# EasyEDA Pro project ProPrj_ESP DigiCam.epro

# Schematic Schematic1
Board Name: Board1; Create Date: 2026-06-13; Page Name: P1; Project Name: ESP DigiCam; Schematic Name: Schematic1; Update Date: 2026-06-13; Company: EasyEDA.com; Page Size: A4; Version: V1.0
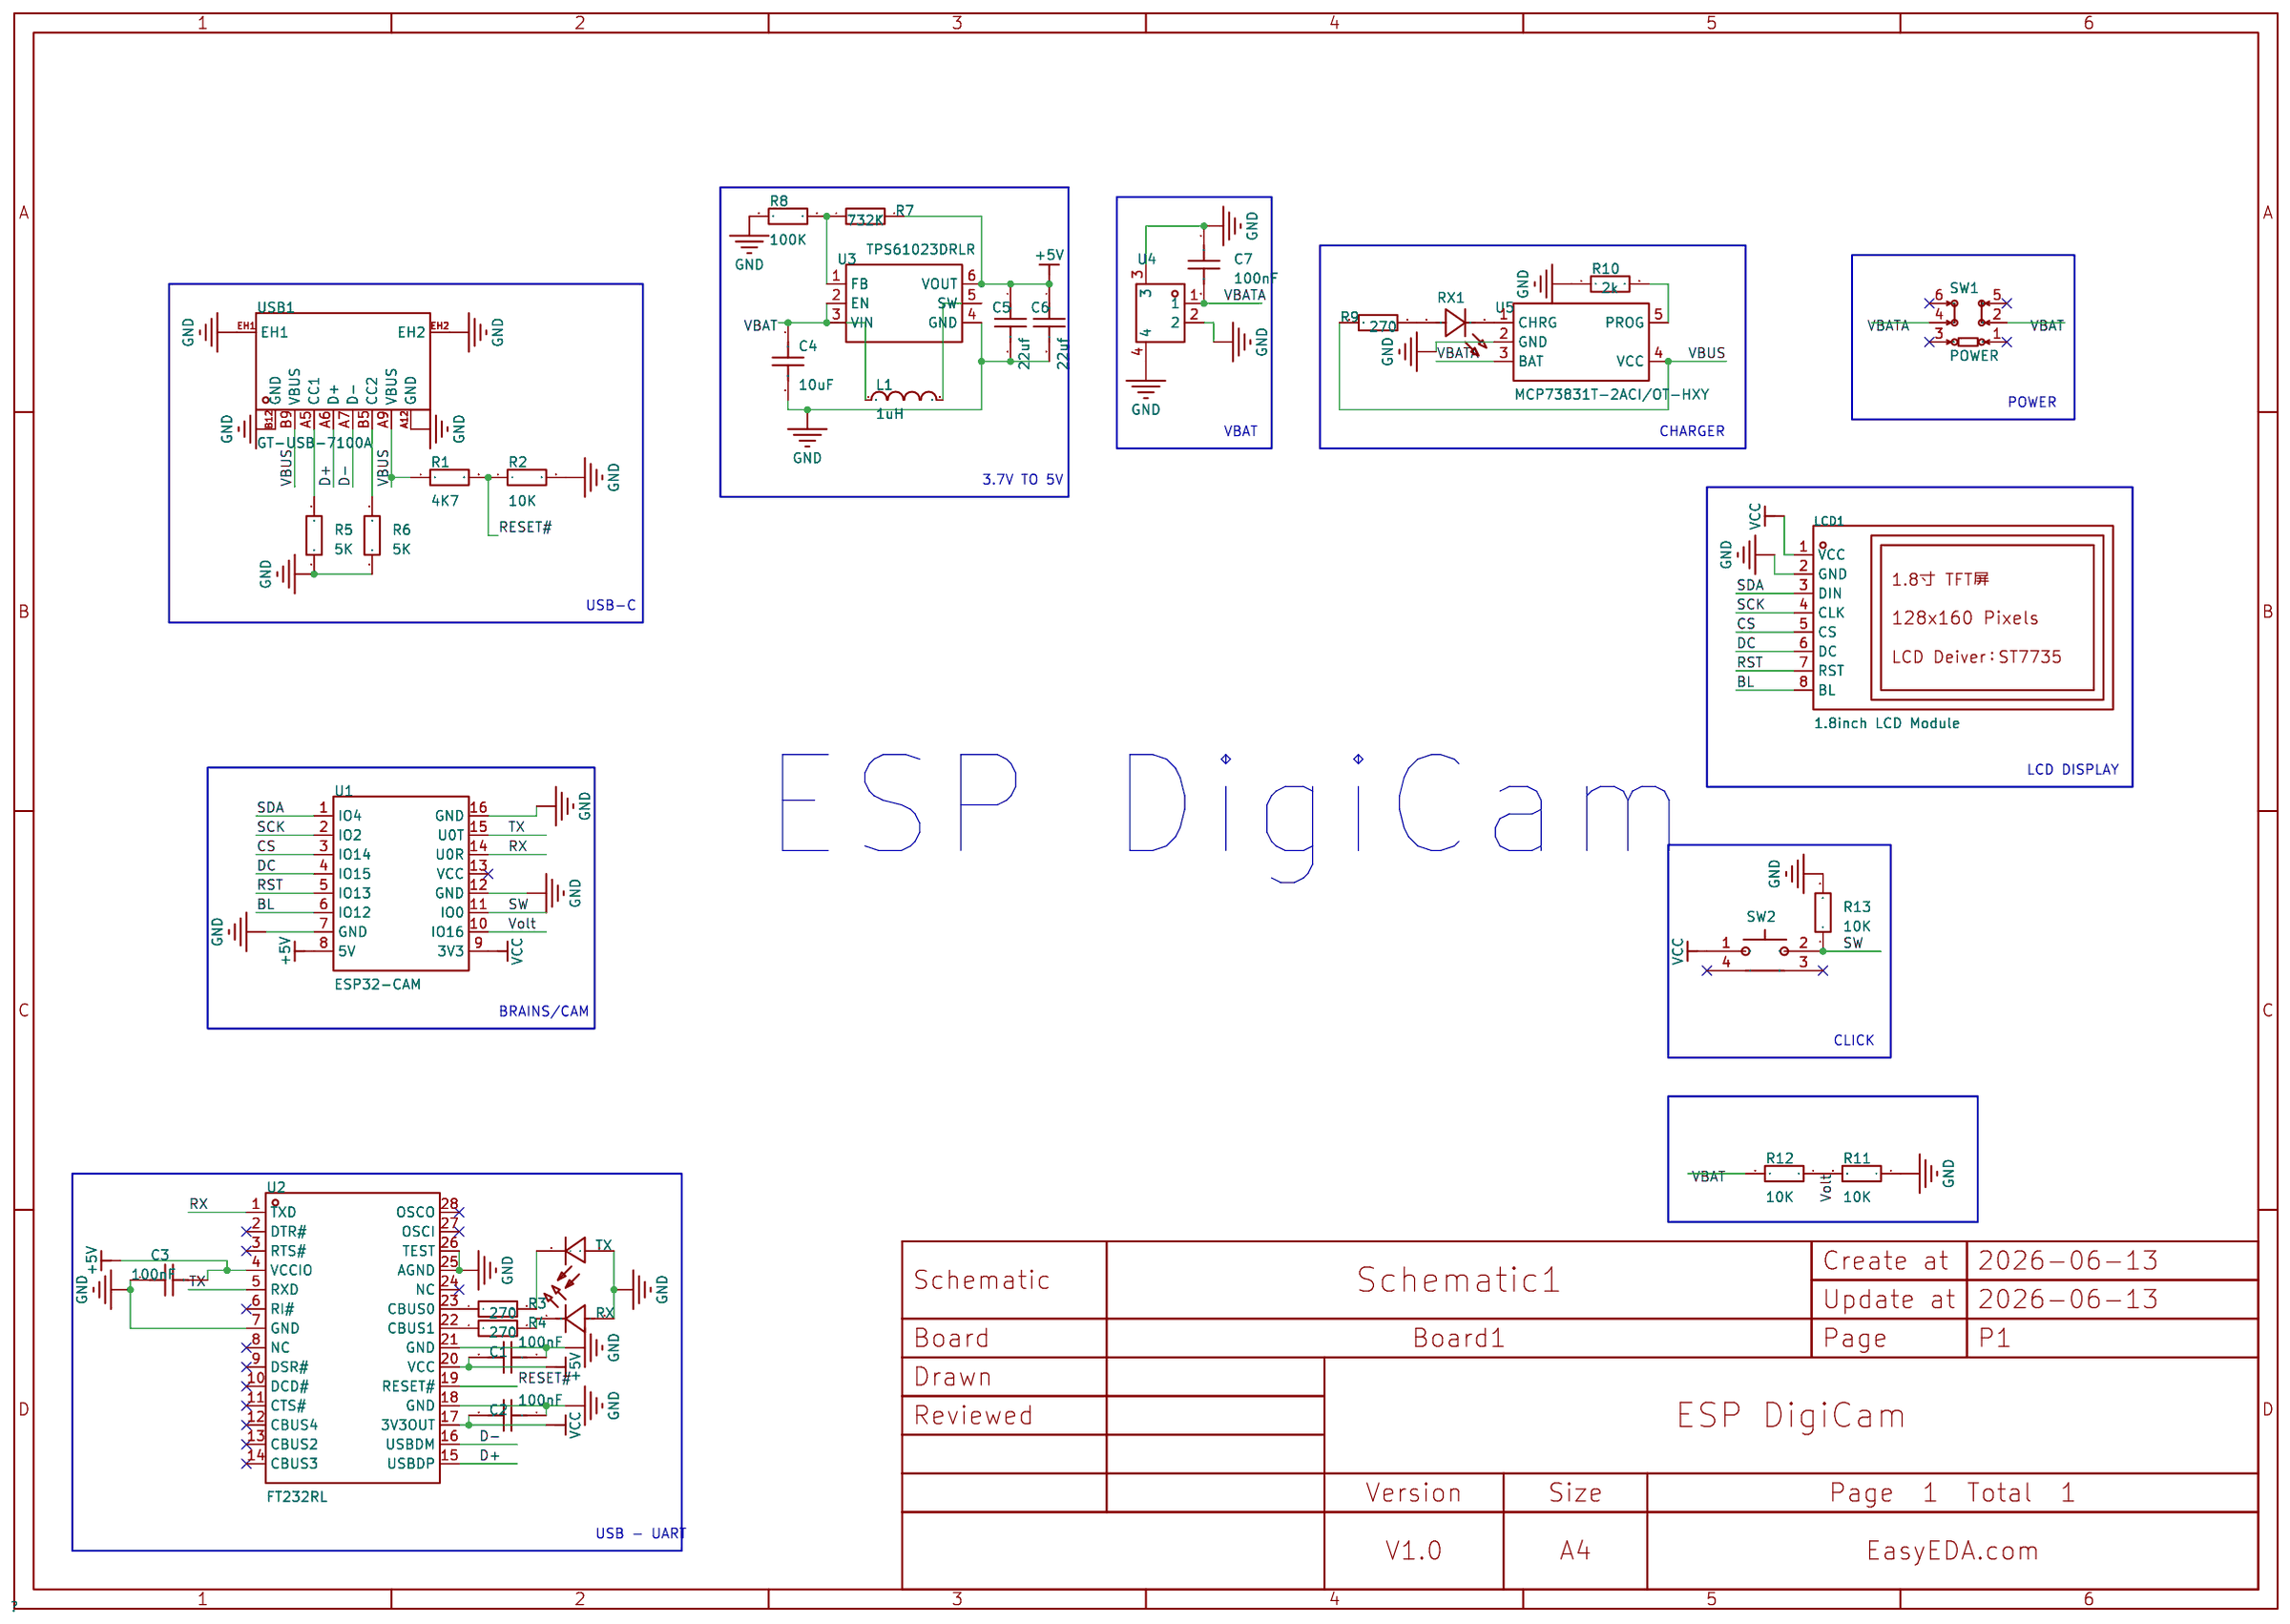
[diagram p0: schematic sheet]

## Parts
C1  100nF  [C0603]
C2  100nF  [C0603]
C3  100nF  [C0603]
C4  10uF  [C0603]
C5  22uf  [C0603]
C6  22uf  [C0603]
C7  100nF  [C0603]
L1  1uH  [IND-SMD_L4.2-W4.2_MCW-0420]
LCD1  1.8inch LCD Module  [LCD-TH_L56.5-W34.0_1-8INCH-LCD-MODULE]
R1  4K7  [R0603]
R2  10K  [R0603]
R3  270  [R0603]
R4  270  [R0603]
R5  5K  [R0603]
R6  5K  [R0603]
R7  732K  [R0603]
R8  100K  [R0603]
R9  270  [R0603]
R10  2k  [R0603]
R11  10K  [R0603]
R12  10K  [R0603]
R13  10K  [R0603]
RX  YLED0603B  [LED0603-FD]
RX1  YLED0603B  [LED0603-FD]
SW1  POWER  [SW-SMD_XKB5858-W-F-75]
SW2  1TS002G-1400-3500-CT  [KEY-SMD_1TS002G]
TX  YLED0603R  [LED0603-FD]
U1  ESP32-CAM  [COMM-TH_16P-L40.0-W27.0-P2.54_ESP32-CAM]
U2  FT232RL  [SSOP-28_L10.2-W5.3-P0.65-LS7.8-BL]
U3  TPS61023DRLR  [SOT-563_L1.6-W1.2-P0.50-LS1.6-BR]
U4  JST Right-Angle Connector - SMD 2-Pin (Black)  [CONN-SMD_JST-PH-2-SMT-RA]
U5  MCP73831T-2ACI/OT-HXY  [SOT-23-5_L2.9-W1.6-P0.95-LS2.8-TL]
USB1  GT-USB-7100A  [USB-C-SMD_GT-USB-7100A]

## Library data of the parts
C1-C7 = CAP_0603: Supplier Footprint: 0603
L1 = 0420CDMCCDS-1R0MC: Inductance: Tolerance:±20% Tolerance:±20% Rated Current: Saturation Current (Isat):8A DC Resistance (DCR): Type:- Ratings:-; LCSC Part Name: 1uH ±20% 8A; Supplier Part: C609522; Manufacturer: Sumida(胜美达); Supplier Footprint: SMD,4.4x4.2mm; JLCPCB Part Class: Extended Part; Datasheet: https://atta.szlcsc.com/upload/public/pdf/source/20200615/C609522_5666D83977AE4FEBC39B900529322ACF.pdf; Supplier: LCSC; Tolerance: ±20%; Saturation Current (Isat): 8A
LCD1 = 1.8inch LCD Module: Controller Type:ST7735S chip Interface:SPI Size:1.8 Dot Pixels:160x128 Operating Temperature:-30℃~+85℃ Operating Temperature:-30℃~+85℃ Display Range:35.4x28.03mm Voltage - Supply:3.3V Voltage - Supply:3.3V Function:Touch; LCSC Part Name: 树莓派 1.8寸LCD 迷你显示屏 扩展板 SPI接口 支持Arduino; Supplier Part: C359940; Manufacturer: Waveshare(微雪电子); JLCPCB Part Class: Extended Part; Datasheet: https://item.szlcsc.com/datasheet/1.8inch%2520LCD%2520Module/334757.html; Supplier: LCSC; Controller Type: ST7735S chip; Interface: SPI; Size: 1.8; Dot Pixels: 160x128; Operating Temperature: -30℃~+85℃; Display Range: 35.4x28.03mm; Voltage - Supply: 3.3V; Function: Touch
R1-R13 = Res_0603: Supplier Footprint: 0603
RX RX1 = YLED0603B: Lamp Holder Type:- Illumination Color:Blue Voltage - Forward(Vf):2.6V~3.2V Voltage - Forward(Vf):2.6V~3.2V Power(Watts):- Forward Current:30mA Wavelength - Dominant:460nm~475nm Wavelength - Dominant:460nm~475nm Peak Wavelength:- Diode Configuration:Discre; LCSC Part Name: 蓝色 独立二极管; Supplier Part: C19171394; Manufacturer: YONGYUTAI(永裕泰); Supplier Footprint: 0603; JLCPCB Part Class: Extended Part; Datasheet: https://item.szlcsc.com/datasheet/YLED0603B/20382445.html; Supplier: LCSC; Illumination Color: Blue; Voltage - Forward(Vf): 2.6V~3.2V; Forward Current: 30mA; Wavelength - Dominant: 460nm~475nm; Diode Configuration: Discrete Diode; Luminous Intensity: 42mcd~86mcd; Viewing Angle: 120°; Operating Temperature: -40℃~+85℃
SW1 = XKB5858-W-F-75: Self Lock / No Lock:Non-Latching Actuator Style:Square Button Mounting Type:Surface Mount, Right Angle Contact Current:100mA Voltage Rating:30V Actuator/Cap Color:White With Lamp:Without Termination Style:Gull Wing Operating Force:2.5N Operating Temperatu; LCSC Part Name: 轻操作力、低接触电阻按键开关; Supplier Part: C780037; Manufacturer: XKB Connection(中国星坤); Supplier Footprint: SMD; JLCPCB Part Class: Extended Part; Datasheet: https://item.szlcsc.com/datasheet/XKB5858-W-F-75/831887.html; Supplier: LCSC; Self Lock / No Lock: Non-Latching; Actuator Style: Square Button; Mounting Type: Surface Mount, Right Angle; Contact Current: 100mA; Voltage Rating: 30V; Actuator/Cap Color: White; With Lamp: Without; Termination Style: Gull Wing; Operating Force: 2.5N; Operating Temperature: -15℃~+55℃; Life: 100,000 cycles
SW2 = 1TS002G-1400-3500-CT: Circuit:SPST Actuator Style:Rectangular Button Operating Force:1.4N Mounting Type:Surface Mount, Right Angle Length:7.6mm Width:3.5mm Switch Height:3.5mm with Bracket:Without Bracket Contact Current:50mA Voltage Rating:12V Actuator/Cap Color:Black With La; LCSC Part Name: 7.6*3.5*3.5mm 卧贴 轻触开关; Supplier Part: C319373; Manufacturer: HYP(鸿源精密); Supplier Footprint: SMD,7.6x3.5mm; JLCPCB Part Class: Extended Part; Datasheet: https://item.szlcsc.com/datasheet/1TS002G-1400-3500-CT/300372.html; Supplier: LCSC; Circuit: SPST; Actuator Style: Rectangular Button; Operating Force: 1.4N; Mounting Type: Surface Mount, Right Angle; Length: 7.6mm; Width: 3.5mm; Switch Height: 3.5mm; with Bracket: Without Bracket; Contact Current: 50mA; Voltage Rating: 12V; Actuator/Cap Color: Black; With Lamp: No; Termination Style: J-Lead; Life: 50,000 Cycles; Operating Temperature: -40℃~+90℃
TX = YLED0603R: Lamp Holder Type:-；- Illumination Color:Red Voltage - Forward(Vf):1.8V~2.4V Voltage - Forward(Vf):1.8V~2.4V Power(Watts):- Forward Current:25mA Wavelength - Dominant:620nm~625nm Wavelength - Dominant:620nm~625nm Peak Wavelength:- Diode Configuration:Discr; LCSC Part Name: 红色 独立二极管; Supplier Part: C19171390; Manufacturer: YONGYUTAI(永裕泰); Supplier Footprint: 0603; JLCPCB Part Class: Extended Part; Datasheet: https://item.szlcsc.com/datasheet/YLED0603R/20382441.html; Supplier: LCSC; Lamp Holder Type: -；-; Illumination Color: Red; Voltage - Forward(Vf): 1.8V~2.4V; Forward Current: 25mA; Wavelength - Dominant: 620nm~625nm; Diode Configuration: Discrete Diode; Luminous Intensity: 120mcd; Viewing Angle: 120°; Operating Temperature: -40℃~+85℃
U1 = ESP32-CAM: Supplier Part: C277946; Manufacturer: Ai-Thinker(安信可); Supplier Footprint: 插件; JLCPCB Part Class: Extended Part; Datasheet: https://item.szlcsc.com/datasheet/ESP32-CAM/265266.html; Supplier: LCSC
U2 = FT232RL: Applications Function:USB to UART Protocol:USB 2.0 Number of Channels:- Voltage - Supply:4V~5.25V；3.3V~5.25V Voltage - Supply:4V~5.25V；3.3V~5.25V Data Rate:- Operating Temperature:-40℃~+85℃ Operating Temperature:-40℃~+85℃; LCSC Part Name: FT232R USB UART IC; Supplier Part: C490691; Manufacturer: FTDI(飞特帝亚); Supplier Footprint: SSOP-28-208mil; JLCPCB Part Class: Extended Part; Datasheet: https://item.szlcsc.com/datasheet/FT232RL/501648.html; Supplier: LCSC; Applications Function: USB to UART; Protocol: USB 2.0; Voltage - Supply: 4V~5.25V；3.3V~5.25V; Operating Temperature: -40℃~+85℃
U3 = TPS61023DRLR: Function:Boost Voltage - Supply:500mV~5.5V Voltage - Supply:500mV~5.5V Output Voltage:2.2V~5.5V Output Voltage:2.2V~5.5V Output Current:3A Frequency - Switching:1MHz Frequency - Switching:1MHz Operating Temperature:-40℃~+125℃@(TJ) Operating Temperature:-4; LCSC Part Name: 升压型 3A 500mV~5.5V; Supplier Part: C919459; Manufacturer: TI(德州仪器); Supplier Footprint: SOT-563; JLCPCB Part Class: Extended Part; Datasheet: https://www.ti.com.cn/cn/lit/ds/symlink/tps61023.pdf?ts=1728812468331&ref_url=https%253A%252F%252Fwww.ti.com.cn%252Fproduct%252Fcn%252FTPS61023; Supplier: LCSC; Function: Boost; Voltage - Supply: 500mV~5.5V; Output Voltage: 2.2V~5.5V; Output Current: 3A; Frequency - Switching: 1MHz; Operating Temperature: -40℃~+125℃@(TJ); Synchronous Rectifier: Yes; Number of Outputs: 1; Topology: Boost; Quiescent Current: 3uA; Switch tube (built-in/external): Built-in; Output Type: Adjustable; Features: Light load efficient mode；Overcurrent Protection；Load disconnect
U4 = JST Right-Angle Connector - SMD 2-Pin (Black): Supplier Part: C9900141337; Supplier Footprint: SMD,P=2mm,2P; JLCPCB Part Class: Extended Part; Supplier: LCSC
U5 = MCP73831T-2ACI/OT-HXY: The Chip Type:Charging IC Voltage - Supply:4.25V~6V Voltage - Supply:4.25V~6V Charge Current - Max:535mA Charging Saturation Voltage:4.2V End-Off Voltage:- Type of Battery:Lithium Battery Number of Cells:1 Number of Cells:1 Operating Temperature:-40℃~+85℃; LCSC Part Name: 独立线性锂电池充电芯片; Supplier Part: C42432883; Manufacturer: HXY MOSFET(华轩阳电子); Supplier Footprint: SOT-23-5L; JLCPCB Part Class: Extended Part; Datasheet: https://item.szlcsc.com/datasheet/MCP73831T-2ACI%252FOT-HXY/44463003.html; Supplier: LCSC; The Chip Type: Charging IC; Voltage - Supply: 4.25V~6V; Charge Current - Max: 535mA; Charging Saturation Voltage: 4.2V; Type of Battery: Lithium Battery; Number of Cells: 1; Operating Temperature: -40℃~+85℃; Battery Temperature Detection: Not supported; 0V Battery Charge: Not supported; Supply Current (Iq): 200uA; Features: Constant voltage charging；Constant current charging；Automatic recharge；Charge termination；Soft-start；Programmable charging current；Under-voltage lockout；Trickle charging
USB1 = GT-USB-7100A: Connector Type:Type-C Protocol Standard:USB 2.0 Gender:Female Mounting Type:Laminated board Number of Contacts:8P Number of Ports:1 Current Rating-Power:5A Voltage Rating:24V Connect-Disconnect Life:10,000 cycles Center Height:0.8mm Length:6.7mm Detection; LCSC Part Name: Type-C 母 沉板; Supplier Part: C7469646; Manufacturer: G-Switch(品赞); Supplier Footprint: SMD; JLCPCB Part Class: Extended Part; Datasheet: https://item.szlcsc.com/datasheet/GT-USB-7100A/8517356.html; Supplier: LCSC; Connector Type: Type-C; Protocol Standard: USB 2.0; Gender: Female; Mounting Type: Laminated board; Number of Contacts: 8P; Number of Ports: 1; Current Rating-Power: 5A; Voltage Rating: 24V; Connect-Disconnect Life: 10,000 cycles; Center Height: 0.8mm; Length: 6.7mm; Detection color: Black; Operating Temperature: -40℃~+85℃

## Nets
+5V: C1.2 C3.2 C5.1 C6.1 R7.2 U1.8(5V) U2.4(VCCIO) U2.20(VCC) U3.6(VOUT)
GND: C1.1 C2.1 C3.1 C4.2 C5.2 C6.2 C7.1 LCD1.2(GND) R2.2 R5.1 R6.1 R8.2 R10.1 R11.1 R13.2 RX.2(A) TX.1(+) U1.7(GND) U1.12(GND) U1.16(GND) U2.7(GND) U2.18(GND) U2.21(GND) U2.25(AGND) U2.26(TEST) U3.4(GND) U4.2 U4.3 U4.4 U5.2(GND) USB1.A12(GND) USB1.B12(GND) USB1.EH1 USB1.EH2
VBAT: C4.1 L1.1 R12.2 SW1.2 U3.2(EN) U3.3(VIN)
VBATA: C7.2 SW1.4 U4.1 U5.3(BAT)
VBUS: R1.1 R9.1 U5.4(VCC) USB1.A9(VBUS) USB1.B9(VBUS)
VCC: C2.2 LCD1.1(VCC) SW2.1 U1.9(3V3) U2.17(3V3OUT)
BL: LCD1.8(BL) U1.6(IO12)
CS: LCD1.5(CS) U1.3(IO14)
D+: U2.15(USBDP) USB1.A6(D+)
D-: U2.16(USBDM) USB1.A7(D-)
DC: LCD1.6(DC) U1.4(IO15)
RESET#: R1.2 R2.1 U2.19(RESET#)
RST: LCD1.7(RST) U1.5(IO13)
RX: U1.14(U0R) U2.1(TXD)
SCK: LCD1.4(CLK) U1.2(IO2)
SDA: LCD1.3(DIN) U1.1(IO4)
SW: R13.1 SW2.2 U1.11(IO0)
TX: U1.15(U0T) U2.5(RXD)
Volt: R11.2 R12.1 U1.10(IO16)
$1N28: R3.1 U2.23(CBUS0)
$1N29: R4.1 U2.22(CBUS1)
$1N30: R4.2 RX.1(K)
$1N31: R3.2 TX.2(-)
$1N39: R5.2 USB1.A5(CC1)
$1N40: R6.2 USB1.B5(CC2)
$1N48: L1.2 U3.5(SW)
$1N53: R7.1 R8.1 U3.1(FB)
$1N55: RX1.1(K) U5.1(CHRG)
$1N56: R9.2 RX1.2(A)
$1N60: R10.2 U5.5(PROG)

Not connected (* = marked no-connect by the designer): SW1 1* 3* 5* 6*; SW2 3* 4*; U1 13(VCC)*; U2 2(DTR#)* 3(RTS#)* 6(RI#)* 8(NC)* 9(DSR#)* 10(DCD#)* 11(CTS#)* 12(CBUS4)* 13(CBUS2)* 14(CBUS3)* 24(NC)* 27(OSCI)* 28(OSCO)*

## Notes on the sheet
- POWER
- VBAT
- CHARGER
- 3.7V TO 5V
- USB-C
- LCD DISPLAY
- ESP DigiCam
- BRAINS/CAM
- CLICK
- USB - UART

# Board PCB1
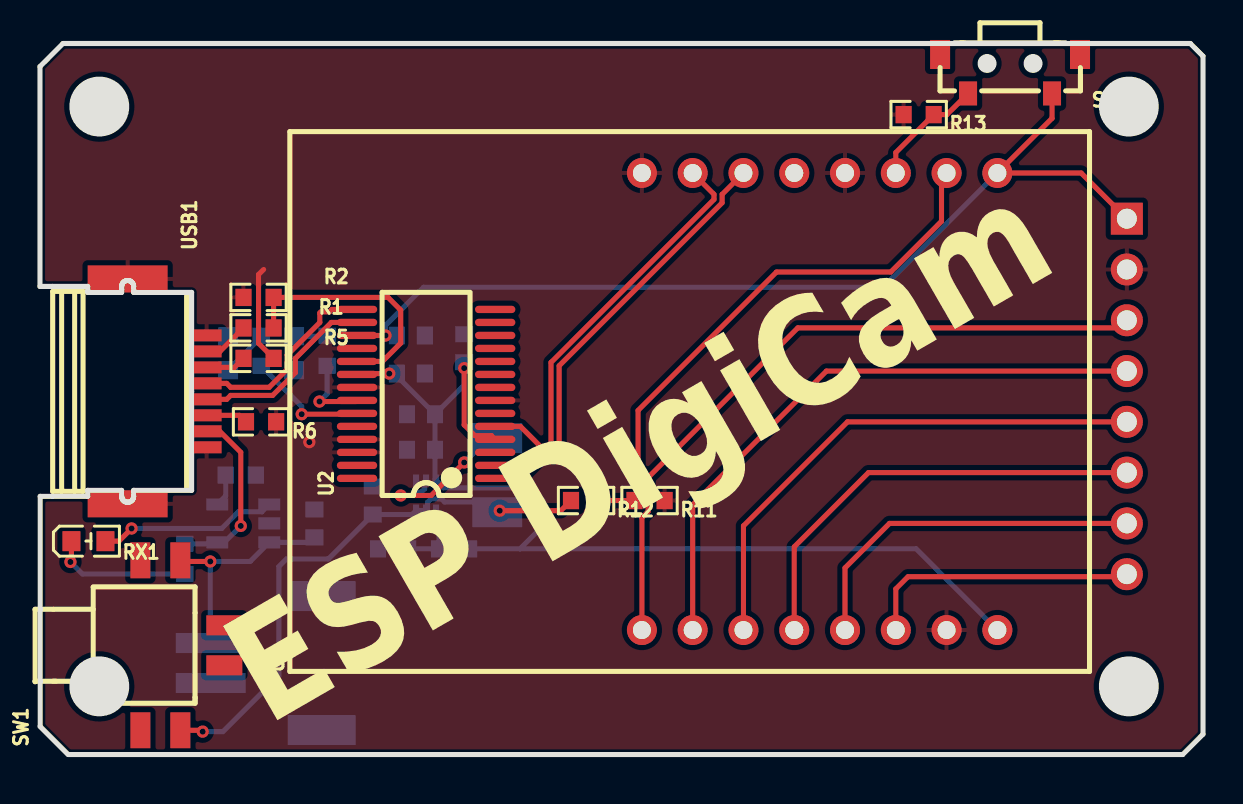
[diagram p1: board, top side]
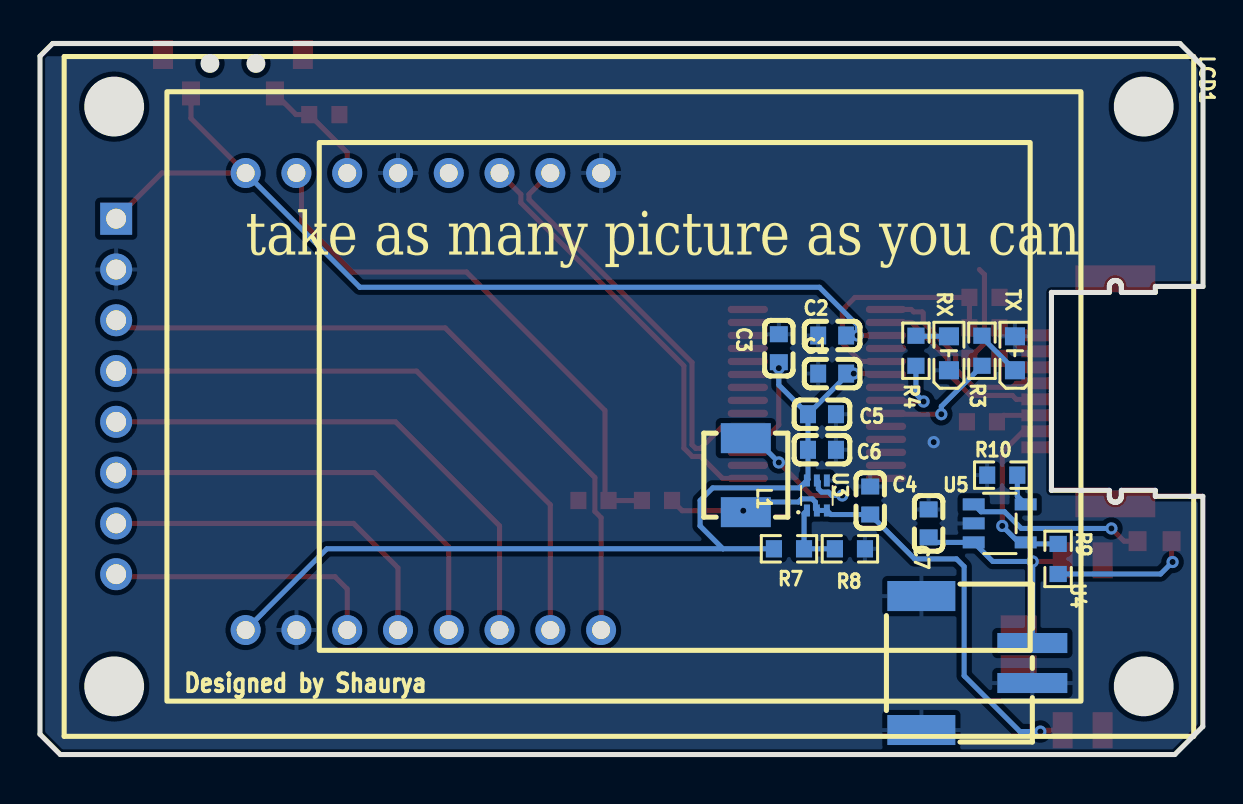
[diagram p2: board, bottom side, seen from below]

Outline 58.18 x 35.56 mm; copper layers: Top Layer, Bottom Layer. Coordinates in mm from the lower left corner of the outline.
Outline path: 0.64,12.91 0.01,12.91 0.01,1.4 1.41,0 57.16,0 58.18,1.02 58.18,34.93 57.54,35.56 1.15,35.56 0,34.41 0,23.41 0.64,23.41
Stack: Top Layer 0.035mm / Dielectric1 1.51mm FR4 er 4.5 / Bottom Layer 0.035mm

## Design rules (mm)
net RX: DP2
net TX: DP2
net D-: DP1
net D+: DP1
spacing copperThickness1oz (default): track to track 0.102, other pairs 0.152 to 0.3
spacing copperThickness2oz: track to track 0.203, other pairs 0.152 to 0.3
track width copperThickness1oz (default): min 0.127, default 0.254, max 2.54
track width copperThickness2oz: min 0.203, default 0.254, max 2.54
differential pair differentialPair (default): width min 0.127, default 0.254, max 2.54; gap min 0.152, default 0.152
net GND uses copperRegion

## Placement (name value [footprint] x y rotation side)
C1  100nF  [C0603]  18.55 19.05 180 bottom
C2  100nF  [C0603]  18.55 20.96 180 bottom
C3  100nF  [C0603]  21.22 20.32 270 bottom
C4  10uF  [C0603]  16.65 12.7 90 bottom
C5  22uf  [C0603]  19.06 17.02 180 bottom
C6  22uf  [C0603]  19.06 15.24 180 bottom
C7  100nF  [C0603]  13.73 11.56 270 bottom
L1  1uH  [IND-SMD_L4.2-W4.2_MCW-0420]  22.87 13.97 90 bottom
LCD1  1.8inch LCD Module  [LCD-TH_L56.5-W34.0_1-8INCH-LCD-MODULE]  54.37 17.91 270 bottom
R1  4K7  [R0603]  10.93 21.34 0 top
R2  10K  [R0603]  10.93 22.86 180 top
R3  270  [R0603]  11.06 20.2 90 bottom
R4  270  [R0603]  14.36 20.2 90 bottom
R5  5K  [R0603]  10.93 19.81 180 top
R6  5K  [R0603]  11.06 16.64 180 top
R7  732K  [R0603]  20.71 10.29 0 bottom
R8  100K  [R0603]  17.66 10.29 180 bottom
R9  270  [R0603]  7.25 9.78 270 bottom
R10  2k  [R0603]  10.04 13.97 180 bottom
R11  10K  [R0603]  30.49 12.7 180 top
R12  10K  [R0603]  27.32 12.7 180 top
R13  10K  [R0603]  43.95 32.01 180 top
RX  YLED0603B  [LED0603-FD]  12.71 20.07 270 bottom
RX1  YLED0603B  [LED0603-FD]  2.42 10.67 180 top
SW1  POWER  [SW-SMD_XKB5858-W-F-75]  7.12 5.46 90 top
SW2  1TS002G-1400-3500-CT  [KEY-SMD_1TS002G]  48.52 34.04 180 top
TX  YLED0603R  [LED0603-FD]  9.41 20.07 270 bottom
U1  ESP32-CAM  [COMM-TH_16P-L40.0-W27.0-P2.54_ESP32-CAM]  39 17.66 90 top
U2  FT232RL  [SSOP-28_L10.2-W5.3-P0.65-LS7.8-BL]  19.31 18.04 90 top
U3  TPS61023DRLR  [SOT-563_L1.6-W1.2-P0.50-LS1.6-BR]  19.31 12.96 270 bottom
U4  JST Right-Angle Connector - SMD 2-Pin (Black)  [CONN-SMD_JST-PH-2-SMT-RA]  11.31 4.57 270 bottom
U5  MCP73831T-2ACI/OT-HXY  [SOT-23-5_L2.9-W1.6-P0.95-LS2.8-TL]  10.17 11.56 180 bottom
USB1  GT-USB-7100A  [USB-C-SMD_GT-USB-7100A]  6.36 18.16 270 top

## Footprints (pads in the part's own frame, mm; a bottom-side part is the same pattern mirrored in y, then rotated)
C0603
  rect 0.8x0.9 smd: 1(-0.7,0) 2(0.7,0)
COMM-TH_16P-L40.0-W27.0-P2.54_ESP32-CAM
  round 1.5 hole 0.9: 1(-11.43,8.89) 2(-11.43,6.35) 3(-11.43,3.81) 4(-11.43,1.27) 5(-11.43,-1.27) 6(-11.43,-3.81) 7(-11.43,-6.35) 8(-11.43,-8.89) 9(11.43,-8.89) 10(11.43,-6.35) 11(11.43,-3.81) 12(11.43,-1.27) 13(11.43,1.27) 14(11.43,3.81) 15(11.43,6.35) 16(11.43,8.89)
CONN-SMD_JST-PH-2-SMT-RA
  rect 1x3.5 smd: 1(-1,2.775) 2(1,2.775)
  rect 1.5x3.4 smd: 3(-3.35,-2.775) 4(3.35,-2.775)
IND-SMD_L4.2-W4.2_MCW-0420
  rect 1.5x2.5 smd: 1(-1.85,0) 2(1.85,0)
KEY-SMD_1TS002G
  rect 0.9x1.2 smd: 1(-2.1,0.975) 2(2.1,0.975)
  rect 1x1.45 smd: 3(3.5,-0.975) 4(-3.5,-0.975)
LCD-TH_L56.5-W34.0_1-8INCH-LCD-MODULE
  rect 1.6x1.6 hole 1: 1(-8.89,0)
  round 1.6 hole 1: 2(-6.35,0) 3(-3.81,0) 4(-1.27,0) 5(1.27,0) 6(3.81,0) 7(6.35,0) 8(8.89,0)
LED0603-FD
  rect 0.9x1 smd: 1(-0.85,0) 2(0.85,0)
R0603
  rect 0.806x0.864 smd: 1(-0.753,0) 2(0.753,0)
SOT-23-5_L2.9-W1.6-P0.95-LS2.8-TL
  rect 1.1x0.6 smd: 1(-1.3,0.95) 2(-1.3,0) 3(-1.3,-0.95) 4(1.3,-0.95) 5(1.3,0.95)
SOT-563_L1.6-W1.2-P0.50-LS1.6-BR
  rect 0.6x0.3 smd: 1(0.75,-0.5) 2(0.75,0) 3(0.75,0.5) 4(-0.75,0.5) 5(-0.75,0) 6(-0.75,-0.5)
SSOP-28_L10.2-W5.3-P0.65-LS7.8-BL
  oval 0.364x2.015 smd: 1(-4.225,-3.455) 2(-3.575,-3.455) 3(-2.925,-3.455) 4(-2.275,-3.455) 5(-1.625,-3.455) 6(-0.975,-3.455) 7(-0.325,-3.455) 8(0.325,-3.455) 9(0.975,-3.455) 10(1.625,-3.455) 11(2.275,-3.455) 12(2.925,-3.455) 13(3.575,-3.455) 14(4.225,-3.455) 15(4.225,3.455) 16(3.575,3.455) 17(2.925,3.455) 18(2.275,3.455) 19(1.625,3.455) 20(0.975,3.455) 21(0.325,3.455) 22(-0.325,3.455) 23(-0.975,3.455) 24(-1.625,3.455) 25(-2.275,3.455) 26(-2.925,3.455) 27(-3.575,3.455) 28(-4.225,3.455)
SW-SMD_XKB5858-W-F-75
  rect 1.8x1 smd: 1(-4.25,2.1) 2(-4.25,0.1) 3(4.25,2.1) 4(4.25,0.1)
  rect 1x1.8 smd: 5(-1,-2.1) 6(1,-2.1)
USB-C-SMD_GT-USB-7100A
  rect 0.6x1.5 smd: A5(-1.2,1.975) A6(-0.4,1.975) A7(0.4,1.975) A9(2,1.975) A12(2.8,1.975) B5(1.2,1.975) B9(-2,1.975) B12(-2.8,1.975)
  rect 1.35x4 smd: EH1(-5.625,-1.975) EH2(5.625,-1.975)

## Nets
As in the schematic.

Pads without a net: SW1 1 3 5 6; SW2 3 4; U1 13; U2 2 3 6 8 9 10 11 12 13 14 24 27 28

## Via types
v1: diameter 0.61, hole 0.305, Top Layer to Bottom Layer, 14 vias

## Routing (per net, layer and track width the routed paths; a pad name or vN(x,y) marks a point on that pad's centre or on a via; arc(x,y) is an arc through that point)
+5V: length 52.4
  Top Layer w0.254: v1(17.47,19.05) 15.9,19.05 U2.20 ; U2.4 22.58,15.95 21.75,15.95 21.22,16.48 v1(21.22,19.33)
  Bottom Layer w0.254: C5.1 17.73,19.05 v1(17.47,19.05) ; C5.1 21.22,18.48 v1(21.22,19.33) ; C5.1 C6.1 19.76,13.76 U3.6 20.18,13.34 24.52,13.34 25.16,12.7 25.16,11.43 24.01,10.29 ; 24.01,10.29 43.83,10.29 47.89,6.23 ; 24.01,10.29 R7.2
GND: length 4.9
  Top Layer w0.254: R5.1 10.93,20.57 10.93,24.01 11.19,24.26
  vias: v1(13.47,15.62)
VBAT: length 27.6
  Top Layer w0.254: R12.2 26.05,12.19 v1(23,12.19) ; v1(8.14,1.15) 8.07,1.21 7.15,1.21
  Bottom Layer w0.254: 22.62,12.63 20.23,12.63 20.08,12.79 19.55,12.79 19.39,12.62 19.39,12.28 U3.2 U3.3 18.61,12 C4.1 14.43,9.78 12.33,9.78 11.95,9.4 11.95,3.94 9.15,1.15 v1(8.14,1.15)
VBATA: length 11.2
  Top Layer w0.254: v1(8.52,9.65) 7.21,9.65 7.15,9.71
  Bottom Layer w0.254: C7.2 13.48,10.61 U5.3 10.52,9.65 v1(8.52,9.65) 8.52,6.36 8.54,6.34 U4.1
VBUS: length 11.3
  Top Layer w0.254: R1.1 9,20.16 8.34,20.16 ; 8.34,16.16 9,16.16 10.04,15.12 v1(10.04,11.43)
  Bottom Layer w0.254: v1(10.04,11.43) 9.22,10.61 U5.4 8.8,10.53 R9.1
VCC: length 48.2
  Top Layer w0.254: v1(17.28,20.96) 15.86,20.96 U2.17 ; LCD1.1 52.08,29.09 47.89,29.09 50.62,31.82 SW2.1
  Bottom Layer w0.254: 47.89,29.09 42.17,23.37 19.19,23.37 17.28,21.47 v1(17.28,20.96)
BL: length 14.4
  Top Layer w0.254: U1.6 42.81,8.28 43.42,8.89 54.87,8.89
CS: length 27.2
  Top Layer w0.254: U1.3 35.19,11.44 40.39,16.64 55,16.64
D+: length 9.9
  Top Layer w0.254: U2.15 14.6,22.26 14.48,22.14 14.05,22.14 14,22.08 14,21.61 12.37,19.98 12.37,19.27 11.47,18.37 9.54,18.37 9.34,18.56 8.34,18.56
D-: length 9.5
  Top Layer w0.254: 8.34,17.76 9.34,17.76 9.54,17.96 11.64,17.96 12.77,19.1 12.77,19.81 14.57,21.61 U2.16
DC: length 23
  Top Layer w0.254: U1.4 37.73,10.39 41.44,14.1 55,14.1
RESET#: length 12.4
  Top Layer w0.254: U2.19 17.13,19.66 18.04,20.58 18.04,22.23 17.41,22.86 R2.1 R1.2
RST: length 18.8
  Top Layer w0.254: 55,11.56 42.49,11.56 40.27,9.33 U1.5
RX: length 21.4
  Top Layer w0.254: U1.14 34.12,28.02 34.12,27.6 25.97,19.44 25.97,15.33 25.55,14.91 25.13,14.91 24.03,13.81 U2.1
SCK: length 31.4
  Top Layer w0.254: 55,19.18 39.34,19.18 32.65,12.49 U1.2
SDA: length 35.5
  Top Layer w0.254: U1.1 30.11,11.84 30.42,12.16 30.42,13.85 37.91,21.34 54.62,21.34 54.62,21.47 LCD1.3
SW: length 5.9
  Top Layer w0.254: U1.11 42.81,30.11 R13.1 45.37,32.01 SW2.2
TX: length 20.7
  Top Layer w0.254: U2.5 24.03,16.41 25.13,15.31 25.38,15.31 25.56,15.49 25.56,19.61 33.72,27.76 33.72,28.02 U1.15
VOLT: length 19.8
  Top Layer w0.254: 29.92,12.88 29.92,17.21 36.84,24.13 42.55,24.13
Volt: length 8
  Top Layer w0.254: 42.55,24.13 45.1,26.67 45.1,28.83 U1.10 ; R12.1 R11.2 29.92,12.88
$1N28: length 6
  Top Layer w0.254: U2.23 15.82,17.02 v1(13.09,17.02)
  Bottom Layer w0.254: R3.1 13.09,17.41 v1(13.09,17.02)
$1N29: length 3.8
  Top Layer w0.254: U2.22 15.8,17.66 v1(13.98,17.66)
  Bottom Layer w0.254: v1(13.98,17.66) 14.36,18.04 R4.1
$1N30: length 1.7
  Bottom Layer w0.254: RX.1 14.33,20.92 R4.2
$1N31: length 2.4
  Bottom Layer w0.254: R3.2 11.06,20.87 TX.2
$1N39: length 2
  Top Layer w0.254: R5.2 9.73,19.36 8.34,19.36
$1N40: length 2.1
  Top Layer w0.254: R6.2 9.98,16.96 8.34,16.96
$1N48: length 7.8
  Top Layer w0.254: v1(18.04,12.96) 19.57,12.96 v1(21.22,14.61)
  Bottom Layer w0.254: L1.2 22.43,15.82 v1(21.22,14.61) ; U3.5 19.24,13.64 19.24,13.29 19.08,13.13 18.73,13.13 18.56,12.96 v1(18.04,12.96)
$1N53: length 3.5
  Bottom Layer w0.254: R8.1 R7.1 19.96,12.06 U3.1
$1N55: length 9
  Top Layer w0.254: v1(4.58,11.31) 3.95,10.67 RX1.1
  Bottom Layer w0.254: v1(4.58,11.31) 9.09,11.31 9.92,12.14 11.1,12.14 U5.1
$1N56: length 7
  Top Layer w0.254: RX1.2 1.57,9.68 v1(1.52,9.63)
  Bottom Layer w0.254: v1(1.52,9.63) 2.12,9.03 R9.2
$1N60: length 1.6
  Bottom Layer w0.254: R10.2 9.29,12.93 U5.5

## Copper pours and planes (outline as drawn; the poured copper is in the pictures)
GND on Top Layer: -0.37,35.69 58.18,35.69 58.18,-0.38 -0.37,-0.38
GND on Bottom Layer: 0.14,34.93 58.3,34.93 58.3,-0.12 0.14,-0.12

## Text on the board
Bottom Silkscreen Layer: Designed by Shaurya | take as many picture as you can
Top Silkscreen Layer: ESP DigiCam
